# EAGLE schematic Darlington TX (EAGLE 6.3)
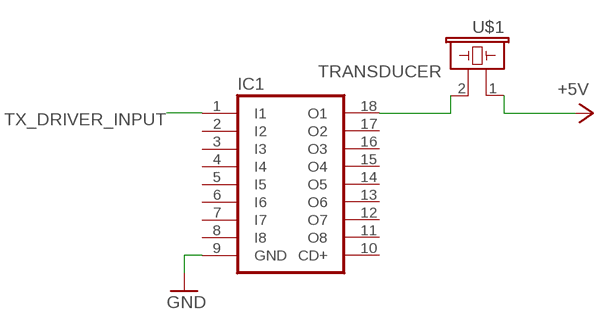
[diagram p0: schematic, sheet 1]

## Parts
IC1  ULN2803A  [DIL18]
U$1  TRANSDUCER  [TRANSDUCER]

## Nets
+5V: U$1.1
GND: IC1.9(GND)
N$1: IC1.18(O1) U$1.2
TX_DRIVER_INPUT: IC1.1(I1)
Unconnected: IC1.2(I2) IC1.3(I3) IC1.4(I4) IC1.5(I5) IC1.6(I6) IC1.7(I7) IC1.8(I8) IC1.10(CD+) IC1.11(O8) IC1.12(O7) IC1.13(O6) IC1.14(O5) IC1.15(O4) IC1.16(O3) IC1.17(O2)

## Library data of the parts
IC1 = uln-udn:ULN2803A: DRIVER ARRAY
U$1 = Ultrasound:TRANSDUCER